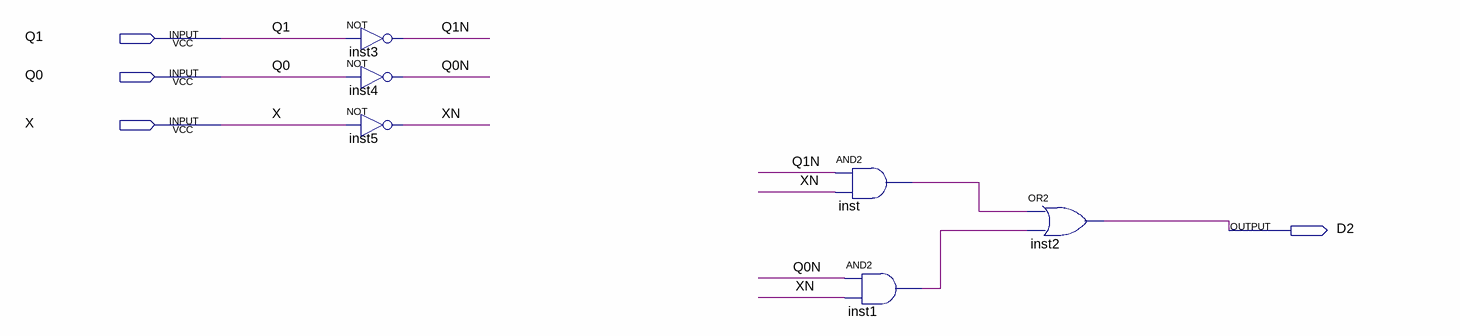
[diagram p0: schematic sheet]
// Quartus schematic D2.bdf as structural Verilog: 6 symbols, 4 pins
module D2 (
  input  Q1,
  input  Q0,
  input  X,
  output D2
);

  wire inst1_out, inst_out, Q0N, Q1N, XN;

  not inst3 (Q1N, Q1);
  not inst4 (Q0N, Q0);
  not inst5 (XN, X);
  and inst (inst_out, Q1N, XN);
  and inst1 (inst1_out, Q0N, XN);
  or inst2 (D2, inst_out, inst1_out);
endmodule
